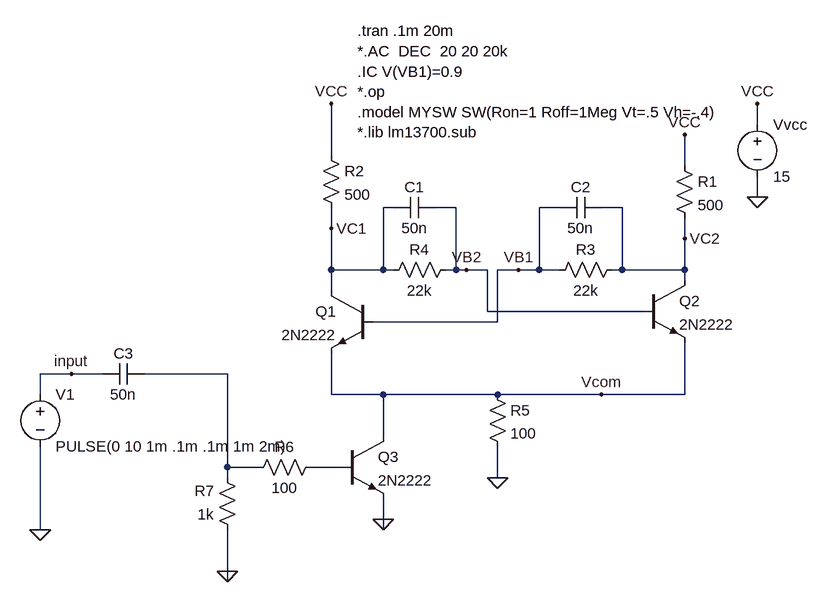
[diagram p0: schematic flipflop.asc]
flipflop.asc, the LTspice schematic file:
Version 4
SHEET 1 1716 680
WIRE 848 -336 848 -368
WIRE 192 -288 192 -368
WIRE 736 -272 736 -320
WIRE 848 -224 848 -256
WIRE 288 -208 272 -208
WIRE 384 -208 352 -208
WIRE 544 -208 512 -208
WIRE 640 -208 608 -208
WIRE 192 -176 192 -208
WIRE 736 -160 736 -192
WIRE 192 -112 192 -176
WIRE 272 -112 272 -208
WIRE 272 -112 192 -112
WIRE 288 -112 272 -112
WIRE 384 -112 384 -208
WIRE 384 -112 368 -112
WIRE 400 -112 384 -112
WIRE 432 -112 400 -112
WIRE 480 -112 448 -112
WIRE 512 -112 512 -208
WIRE 512 -112 480 -112
WIRE 544 -112 512 -112
WIRE 640 -112 640 -208
WIRE 640 -112 624 -112
WIRE 736 -112 736 -160
WIRE 736 -112 640 -112
WIRE 736 -96 736 -112
WIRE 192 -80 192 -112
WIRE 432 -48 432 -112
WIRE 496 -48 432 -48
WIRE 672 -48 496 -48
WIRE 336 -32 256 -32
WIRE 448 -32 448 -112
WIRE 448 -32 336 -32
WIRE -208 48 -256 48
WIRE -160 48 -208 48
WIRE 32 48 -96 48
WIRE -256 80 -256 48
WIRE 192 80 192 16
WIRE 272 80 192 80
WIRE 448 80 272 80
WIRE 608 80 448 80
WIRE 736 80 736 0
WIRE 736 80 608 80
WIRE 272 144 272 80
WIRE 32 192 32 48
WIRE 80 192 32 192
WIRE 208 192 160 192
WIRE 32 208 32 192
WIRE 448 208 448 160
WIRE 272 272 272 240
WIRE -256 288 -256 160
WIRE 272 288 272 272
WIRE 32 352 32 288
WIRE 32 368 32 352
FLAG 848 -224 0
FLAG 848 -368 VCC
FLAG 448 208 0
FLAG 192 -368 VCC
FLAG 736 -320 VCC
FLAG 400 -112 VB2
FLAG 480 -112 VB1
FLAG 192 -176 VC1
FLAG 736 -160 VC2
FLAG -256 288 0
FLAG 272 272 0
FLAG 608 80 Vcom
FLAG 32 352 0
FLAG -208 48 input
DATAFLAG 496 -48 "$"
DATAFLAG 336 -32 "$"
SYMBOL voltage 848 -352 R0
WINDOW 123 0 0 Left 2
WINDOW 39 0 0 Left 2
SYMATTR InstName Vvcc
SYMATTR Value 15
SYMBOL npn 256 -80 M0
SYMATTR InstName Q1
SYMATTR Value 2N2222
SYMBOL npn 672 -96 R0
SYMATTR InstName Q2
SYMATTR Value 2N2222
SYMBOL res 720 -288 R0
SYMATTR InstName R1
SYMATTR Value 500
SYMBOL res 176 -304 R0
SYMATTR InstName R2
SYMATTR Value 500
SYMBOL res 640 -128 R90
WINDOW 0 0 56 VBottom 2
WINDOW 3 32 56 VTop 2
SYMATTR InstName R3
SYMATTR Value 22k
SYMBOL res 384 -128 R90
WINDOW 0 0 56 VBottom 2
WINDOW 3 32 56 VTop 2
SYMATTR InstName R4
SYMATTR Value 22k
SYMBOL cap 352 -224 R90
WINDOW 0 0 32 VBottom 2
WINDOW 3 32 32 VTop 2
SYMATTR InstName C1
SYMATTR Value 50n
SYMBOL cap 608 -224 R90
WINDOW 0 0 32 VBottom 2
WINDOW 3 32 32 VTop 2
SYMATTR InstName C2
SYMATTR Value 50n
SYMBOL res 432 64 R0
SYMATTR InstName R5
SYMATTR Value 100
SYMBOL voltage -256 64 R0
SYMATTR InstName V1
SYMATTR Value PULSE(0 10 1m .1m .1m 1m 2m)
SYMBOL npn 208 144 R0
SYMATTR InstName Q3
SYMATTR Value 2N2222
SYMBOL res 176 176 R90
WINDOW 0 0 56 VBottom 2
WINDOW 3 32 56 VTop 2
SYMATTR InstName R6
SYMATTR Value 100
SYMBOL cap -160 64 R270
WINDOW 0 32 32 VTop 2
WINDOW 3 0 32 VBottom 2
SYMATTR InstName C3
SYMATTR Value 50n
SYMBOL res 48 304 R180
WINDOW 0 36 76 Left 2
WINDOW 3 36 40 Left 2
SYMATTR InstName R7
SYMATTR Value 1k
TEXT 232 -480 Left 2 !.tran .1m 20m\n*.AC  DEC  20 20 20k\n.IC V(VB1)=0.9\n*.op\n.model MYSW SW(Ron=1 Roff=1Meg Vt=.5 Vh=-.4)\n*.lib lm13700.sub

The netlist it stands for:
* flipflop.asc
Vvcc VCC 0 15
Q1 VC1 VB1 Vcom 0 2N2222
Q2 VC2 VB2 Vcom 0 2N2222
R1 VCC VC2 500
R2 VCC VC1 500
R3 VC2 VB1 22k
R4 VB2 VC1 22k
C1 VB2 VC1 50n
C2 VC2 VB1 50n
R5 Vcom 0 100
V1 input 0 PULSE(0 10 1m .1m .1m 1m 2m)
Q3 Vcom N002 0 0 2N2222
R6 N002 N001 100
C3 input N001 50n
R7 0 N001 1k
.model NPN NPN
.model PNP PNP
.lib standard.bjt
.tran .1m 20m
*.AC  DEC  20 20 20k
.IC V(VB1)=0.9
*.op
.model MYSW SW(Ron=1 Roff=1Meg Vt=.5 Vh=-.4)
*.lib lm13700.sub
.backanno
.end